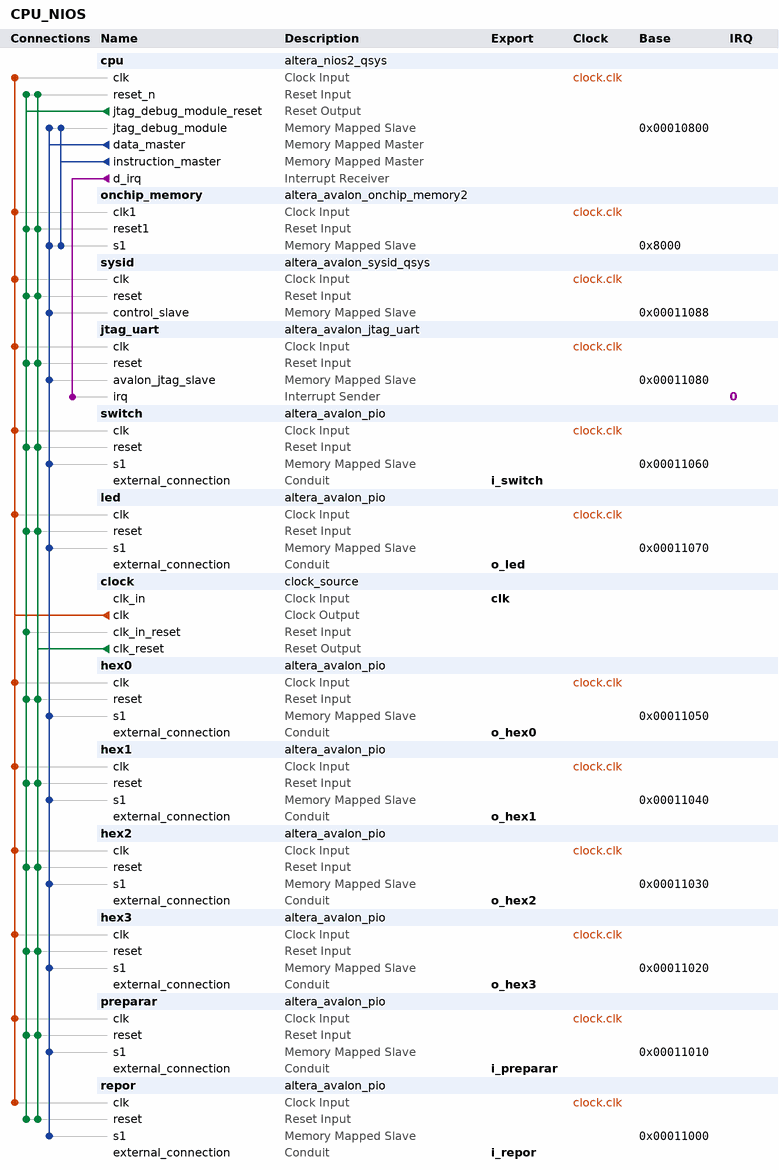
[diagram p0: system contents]
# Platform Designer (Qsys) system CPU_NIOS, Cyclone III EP3C16F484C6
# Parameters at their usual value, and those the tool derives, are not listed.
package require -exact qsys 13.1
create_system CPU_NIOS
set_project_property DEVICE_FAMILY {Cyclone III}
set_project_property DEVICE EP3C16F484C6

add_instance cpu altera_nios2_qsys 13.1
set_instance_parameter_value cpu resetSlave onchip_memory.s1
set_instance_parameter_value cpu mmu_TLBMissExcSlave None
set_instance_parameter_value cpu exceptionSlave onchip_memory.s1
set_instance_parameter_value cpu breakSlave cpu.jtag_debug_module
set_instance_parameter_value cpu impl Fast
set_instance_parameter_value cpu icache_size 4096

add_instance onchip_memory altera_avalon_onchip_memory2 13.1
set_instance_parameter_value onchip_memory dataWidth 32
set_instance_parameter_value onchip_memory dualPort false
set_instance_parameter_value onchip_memory initMemContent true
set_instance_parameter_value onchip_memory initializationFileName onchip_mem.hex
set_instance_parameter_value onchip_memory memorySize 32768

add_instance sysid altera_avalon_sysid_qsys 13.1
set_instance_parameter_value sysid id 0

add_instance jtag_uart altera_avalon_jtag_uart 13.1
set_instance_parameter_value jtag_uart simInteractiveOptions NO_INTERACTIVE_WINDOWS

add_instance switch altera_avalon_pio 13.1
set_instance_parameter_value switch direction Input
set_instance_parameter_value switch width 10

add_instance led altera_avalon_pio 13.1
set_instance_parameter_value led direction Output
set_instance_parameter_value led width 10

add_instance clock clock_source 13.1
set_instance_parameter_value clock clockFrequency 50000000

add_instance hex0 altera_avalon_pio 13.1
set_instance_parameter_value hex0 direction Output
set_instance_parameter_value hex0 width 7

add_instance hex1 altera_avalon_pio 13.1
set_instance_parameter_value hex1 direction Output
set_instance_parameter_value hex1 width 7

add_instance hex2 altera_avalon_pio 13.1
set_instance_parameter_value hex2 direction Output
set_instance_parameter_value hex2 width 7

add_instance hex3 altera_avalon_pio 13.1
set_instance_parameter_value hex3 direction Output
set_instance_parameter_value hex3 width 7

add_instance preparar altera_avalon_pio 13.1
set_instance_parameter_value preparar direction Input
set_instance_parameter_value preparar width 1

add_instance repor altera_avalon_pio 13.1
set_instance_parameter_value repor direction Input
set_instance_parameter_value repor width 1

# connections
add_connection clock.clk cpu.clk clock
add_connection clock.clk hex0.clk clock
add_connection clock.clk hex1.clk clock
add_connection clock.clk hex2.clk clock
add_connection clock.clk hex3.clk clock
add_connection clock.clk jtag_uart.clk clock
add_connection clock.clk led.clk clock
add_connection clock.clk onchip_memory.clk1 clock
add_connection clock.clk preparar.clk clock
add_connection clock.clk repor.clk clock
add_connection clock.clk switch.clk clock
add_connection clock.clk sysid.clk clock
add_connection clock.clk_reset cpu.reset_n reset
add_connection clock.clk_reset hex0.reset reset
add_connection clock.clk_reset hex1.reset reset
add_connection clock.clk_reset hex2.reset reset
add_connection clock.clk_reset hex3.reset reset
add_connection clock.clk_reset jtag_uart.reset reset
add_connection clock.clk_reset led.reset reset
add_connection clock.clk_reset onchip_memory.reset1 reset
add_connection clock.clk_reset preparar.reset reset
add_connection clock.clk_reset repor.reset reset
add_connection clock.clk_reset switch.reset reset
add_connection clock.clk_reset sysid.reset reset
add_connection cpu.jtag_debug_module_reset clock.clk_in_reset reset
add_connection cpu.jtag_debug_module_reset cpu.reset_n reset
add_connection cpu.jtag_debug_module_reset hex0.reset reset
add_connection cpu.jtag_debug_module_reset hex1.reset reset
add_connection cpu.jtag_debug_module_reset hex2.reset reset
add_connection cpu.jtag_debug_module_reset hex3.reset reset
add_connection cpu.jtag_debug_module_reset jtag_uart.reset reset
add_connection cpu.jtag_debug_module_reset led.reset reset
add_connection cpu.jtag_debug_module_reset onchip_memory.reset1 reset
add_connection cpu.jtag_debug_module_reset preparar.reset reset
add_connection cpu.jtag_debug_module_reset repor.reset reset
add_connection cpu.jtag_debug_module_reset switch.reset reset
add_connection cpu.jtag_debug_module_reset sysid.reset reset
add_connection cpu.data_master cpu.jtag_debug_module avalon
set_connection_parameter_value cpu.data_master/cpu.jtag_debug_module baseAddress 0x00010800
add_connection cpu.data_master hex0.s1 avalon
set_connection_parameter_value cpu.data_master/hex0.s1 baseAddress 0x00011050
add_connection cpu.data_master hex1.s1 avalon
set_connection_parameter_value cpu.data_master/hex1.s1 baseAddress 0x00011040
add_connection cpu.data_master hex2.s1 avalon
set_connection_parameter_value cpu.data_master/hex2.s1 baseAddress 0x00011030
add_connection cpu.data_master hex3.s1 avalon
set_connection_parameter_value cpu.data_master/hex3.s1 baseAddress 0x00011020
add_connection cpu.data_master jtag_uart.avalon_jtag_slave avalon
set_connection_parameter_value cpu.data_master/jtag_uart.avalon_jtag_slave baseAddress 0x00011080
add_connection cpu.data_master led.s1 avalon
set_connection_parameter_value cpu.data_master/led.s1 baseAddress 0x00011070
add_connection cpu.data_master onchip_memory.s1 avalon
set_connection_parameter_value cpu.data_master/onchip_memory.s1 baseAddress 0x8000
add_connection cpu.data_master preparar.s1 avalon
set_connection_parameter_value cpu.data_master/preparar.s1 baseAddress 0x00011010
add_connection cpu.data_master repor.s1 avalon
set_connection_parameter_value cpu.data_master/repor.s1 baseAddress 0x00011000
add_connection cpu.data_master switch.s1 avalon
set_connection_parameter_value cpu.data_master/switch.s1 baseAddress 0x00011060
add_connection cpu.data_master sysid.control_slave avalon
set_connection_parameter_value cpu.data_master/sysid.control_slave baseAddress 0x00011088
add_connection cpu.instruction_master cpu.jtag_debug_module avalon
set_connection_parameter_value cpu.instruction_master/cpu.jtag_debug_module baseAddress 0x00010800
add_connection cpu.instruction_master onchip_memory.s1 avalon
set_connection_parameter_value cpu.instruction_master/onchip_memory.s1 baseAddress 0x8000
add_connection cpu.d_irq jtag_uart.irq interrupt
set_connection_parameter_value cpu.d_irq/jtag_uart.irq irqNumber 0

# exported interfaces
add_interface i_switch conduit end
set_interface_property i_switch EXPORT_OF switch.external_connection
add_interface o_led conduit end
set_interface_property o_led EXPORT_OF led.external_connection
add_interface clk clock sink
set_interface_property clk EXPORT_OF clock.clk_in
add_interface o_hex0 conduit end
set_interface_property o_hex0 EXPORT_OF hex0.external_connection
add_interface o_hex1 conduit end
set_interface_property o_hex1 EXPORT_OF hex1.external_connection
add_interface o_hex2 conduit end
set_interface_property o_hex2 EXPORT_OF hex2.external_connection
add_interface o_hex3 conduit end
set_interface_property o_hex3 EXPORT_OF hex3.external_connection
add_interface i_preparar conduit end
set_interface_property i_preparar EXPORT_OF preparar.external_connection
add_interface i_repor conduit end
set_interface_property i_repor EXPORT_OF repor.external_connection

set_interconnect_requirement {$system} qsys_mm.clockCrossingAdapter HANDSHAKE
set_interconnect_requirement {$system} qsys_mm.maxAdditionalLatency 1
set_interconnect_requirement {$system} qsys_mm.insertDefaultSlave false

save_system CPU_NIOS.qsys
